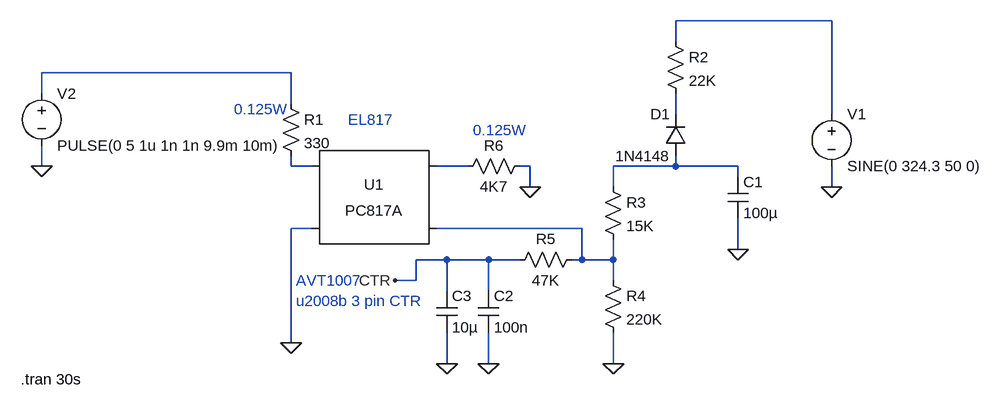
[diagram p0: schematic u2008b.asc]
u2008b.asc, the LTspice schematic file:
Version 4
SHEET 1 1044 680
WIRE 816 -112 576 -112
WIRE 576 -80 576 -112
WIRE -16 -32 -400 -32
WIRE -400 0 -400 -32
WIRE -16 16 -16 -32
WIRE 576 32 576 0
WIRE 816 32 816 -112
WIRE -400 112 -400 80
WIRE -16 112 -16 96
WIRE 16 112 -16 112
WIRE 256 112 208 112
WIRE 352 112 336 112
WIRE 576 112 576 96
WIRE 576 112 480 112
WIRE 672 112 576 112
WIRE 672 128 672 112
WIRE 352 144 352 112
WIRE 480 144 480 112
WIRE 816 144 816 112
WIRE 16 208 -16 208
WIRE 432 208 208 208
WIRE 672 240 672 192
WIRE 224 256 176 256
WIRE 288 256 224 256
WIRE 336 256 288 256
WIRE 432 256 432 208
WIRE 432 256 416 256
WIRE 480 256 480 224
WIRE 480 256 432 256
WIRE 176 288 176 256
WIRE 176 288 144 288
WIRE 480 288 480 256
WIRE 224 304 224 256
WIRE 288 304 288 256
WIRE -16 384 -16 208
WIRE 224 416 224 368
WIRE 288 416 288 368
WIRE 480 416 480 368
FLAG -16 384 0
FLAG -400 112 0
FLAG 816 144 0
FLAG 672 240 0
FLAG 480 416 0
FLAG 288 416 0
FLAG 224 416 0
FLAG 352 144 0
FLAG 144 288 CTR
SYMBOL Optos\\PC817A 112 160 R0
SYMATTR InstName U1
SYMBOL res -32 0 R0
SYMATTR InstName R1
SYMATTR Value 330
SYMBOL voltage -400 -16 R0
WINDOW 123 0 0 Left 2
WINDOW 39 0 0 Left 2
SYMATTR InstName V2
SYMATTR Value PULSE(0 5 1u 1n 1n 9.9m 10m)
SYMBOL voltage 816 16 R0
WINDOW 123 0 0 Left 2
WINDOW 39 0 0 Left 2
SYMATTR InstName V1
SYMATTR Value SINE(0 324.3 50 0)
SYMBOL res 560 -96 R0
SYMATTR InstName R2
SYMATTR Value 22K
SYMBOL diode 592 96 R180
WINDOW 0 24 64 Left 2
WINDOW 3 24 0 Left 2
SYMATTR InstName D1
SYMATTR Value 1N4148
SYMBOL cap 656 128 R0
SYMATTR InstName C1
SYMATTR Value 100µ
SYMBOL res 464 128 R0
SYMATTR InstName R3
SYMATTR Value 15K
SYMBOL res 464 272 R0
SYMATTR InstName R4
SYMATTR Value 220K
SYMBOL res 432 240 R90
WINDOW 0 0 56 VBottom 2
WINDOW 3 32 56 VTop 2
SYMATTR InstName R5
SYMATTR Value 47K
SYMBOL cap 272 304 R0
SYMATTR InstName C2
SYMATTR Value 100n
SYMBOL cap 208 304 R0
SYMATTR InstName C3
SYMATTR Value 10µ
SYMBOL res 352 96 R90
WINDOW 0 0 56 VBottom 2
WINDOW 3 32 56 VTop 2
SYMATTR InstName R6
SYMATTR Value 4K7
TEXT 72 40 Left 2 ;EL817
TEXT -432 440 Left 2 !.tran 30s
TEXT 264 56 Left 2 ;0.125W
TEXT -104 24 Left 2 ;0.125W
TEXT -8 288 Left 2 ;AVT1007\nu2008b 3 pin CTR

The netlist it stands for:
* u2008b.asc
XU1 N004 0 N005 N007 PC817 Igain=1m
R1 N002 N004 330
V2 N002 0 PULSE(0 5 1u 1n 1n 9.9m 10m)
V1 N001 0 SINE(0 324.3 50 0)
R2 N001 N003 22K
D1 N006 N003 1N4148
C1 N006 0 100µ
R3 N006 N007 15K
R4 N007 0 220K
R5 N007 CTR 47K
C2 CTR 0 100n
C3 CTR 0 10µ
R6 0 N005 4K7
.model D D
.lib standard.dio
* EL817
.tran 30s
* 0.125W
* 0.125W
* AVT1007
* u2008b 3 pin CTR
.lib PC817.sub
.backanno
.end